# EAGLE design LSS (EAGLE 9.3.0)
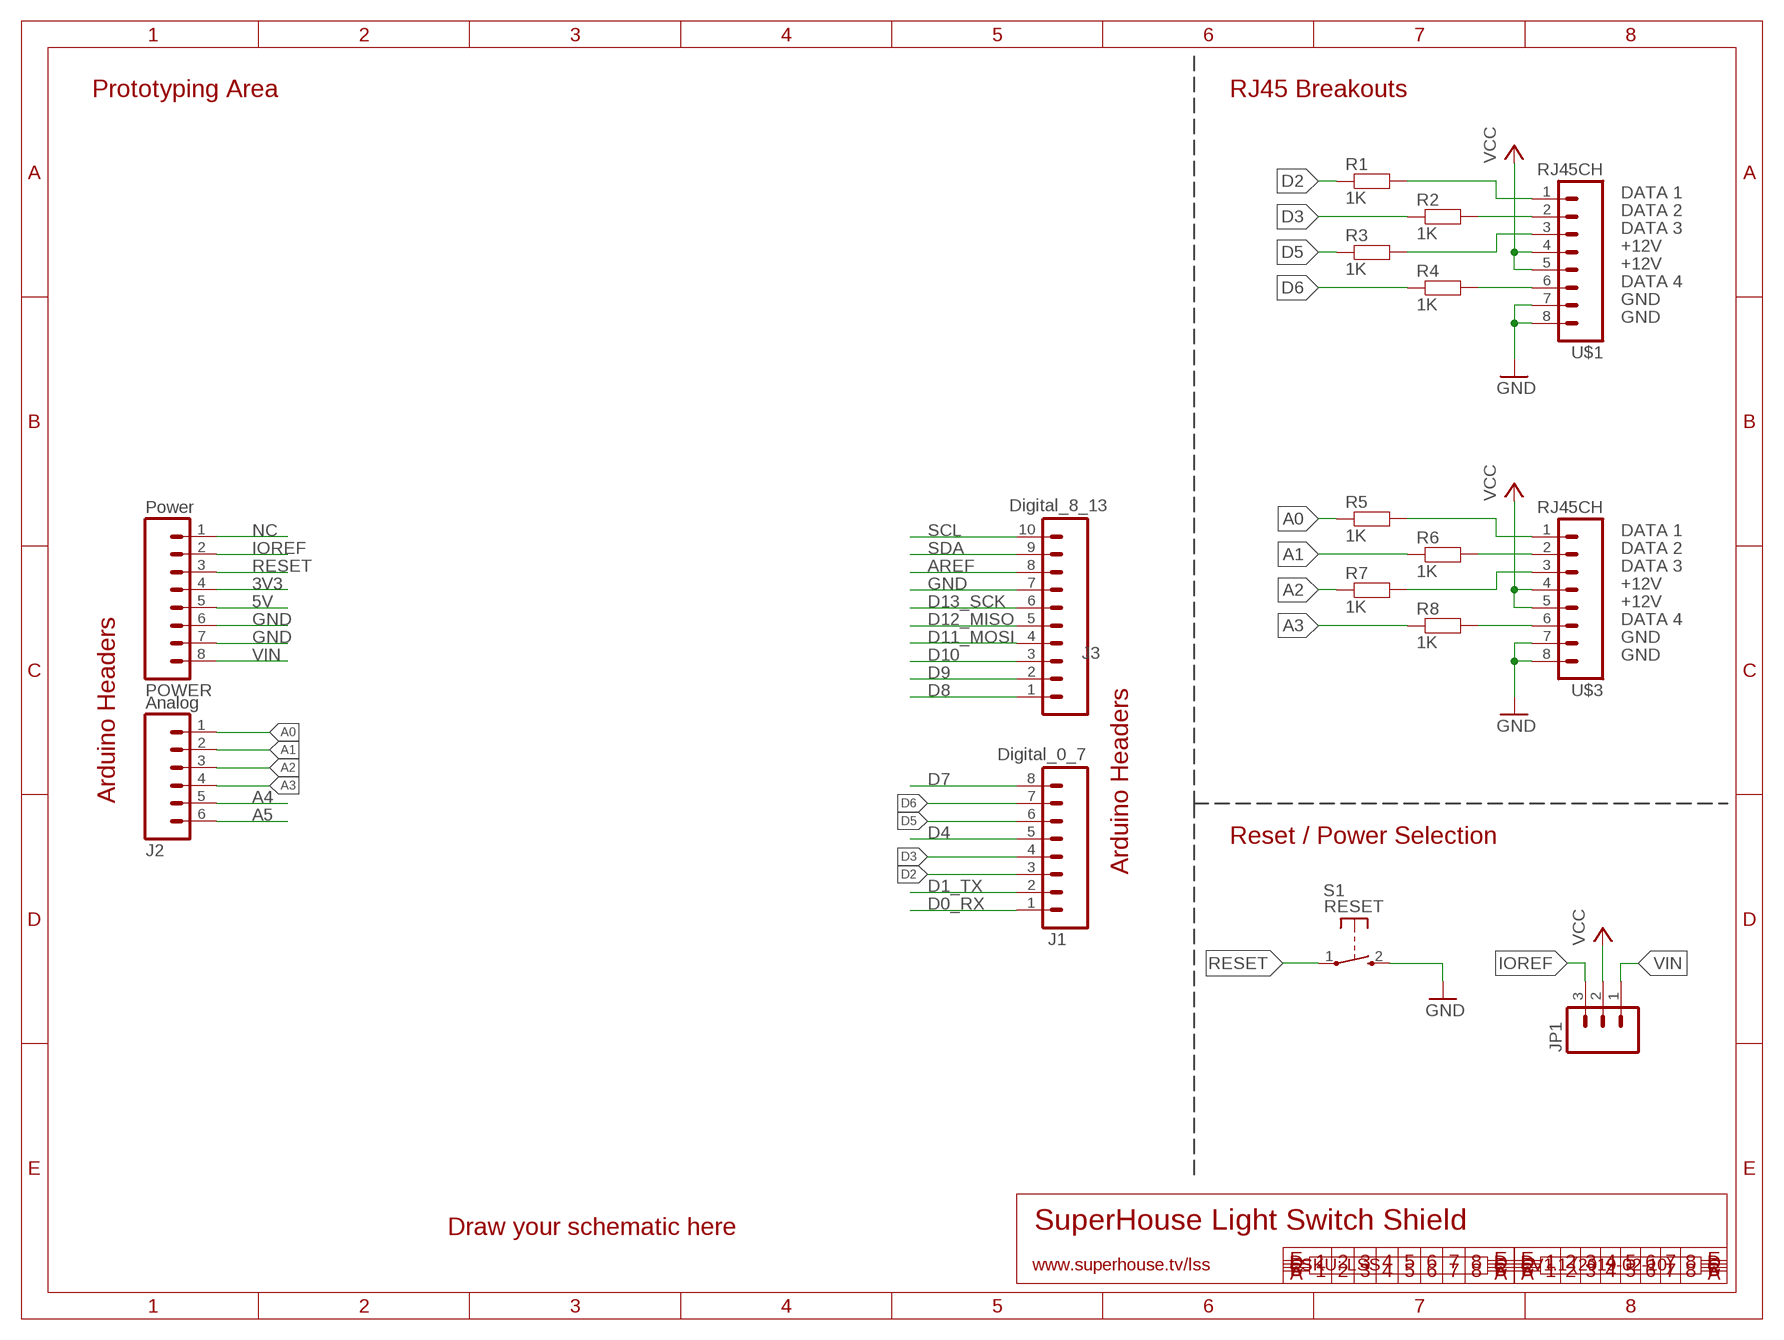
[diagram p0: schematic, sheet 1]

## Parts
J1  Digital_0_7  M08  [1X08]
J2  Analog  M06SIP  [1X06]
J3  Digital_8_13  M100.1  [1X10]
JP1  M03PTH  [1X03]
POWER  Power  M08  [1X08]
R1  1K  RESISTOR0603  [0603]
R2  1K  RESISTOR0603  [0603]
R3  1K  RESISTOR0603  [0603]
R4  1K  RESISTOR0603  [0603]
R5  1K  RESISTOR0603  [0603]
R6  1K  RESISTOR0603  [0603]
R7  1K  RESISTOR0603  [0603]
R8  1K  RESISTOR0603  [0603]
S1  RESET  TAC_SWITCH_2PINSMT  [TACTILE_SWITCH_SMD_2PIN_TINY]
U$1  RJ45CH  [RJ45CH]
U$3  RJ45CH  [RJ45CH]

## Nets
3V3: POWER.4
5V: POWER.5
A0: J2.1 R5.1
A1: J2.2 R6.1
A2: J2.3 R7.1
A3: J2.4 R8.1
A4: J2.5
A5: J2.6
AREF: J3.8
D0_RX: J1.1
D1_TX: J1.2
D2: J1.3 R1.1
D3: J1.4 R2.1
D4: J1.5
D5: J1.6 R3.1
D6: J1.7 R4.1
D7: J1.8
D8: J3.1
D9: J3.2
D10: J3.3
D11_MOSI: J3.4
D12_MISO: J3.5
D13_SCK: J3.6
GND: J3.7 POWER.6 POWER.7 S1.2(S) U$1.7 U$1.8 U$3.7 U$3.8
IOREF: JP1.3 POWER.2
N$1: R1.2 U$1.1
N$2: R2.2 U$1.2
N$3: R3.2 U$1.3
N$4: R4.2 U$1.6
N$5: R5.2 U$3.1
N$6: R6.2 U$3.2
N$7: R7.2 U$3.3
N$8: R8.2 U$3.6
NC: POWER.1
RESET: POWER.3 S1.1(P)
SCL: J3.10
SDA: J3.9
VCC: JP1.2 U$1.4 U$1.5 U$3.4 U$3.5
VIN: JP1.1 POWER.8

## Notes on the sheet
- Prototyping Area | RJ45 Breakouts
- DATA 1
- DATA 2
- DATA 3
- +12V
- +12V
- DATA 4
- GND
- GND
- DATA 1
- DATA 2
- DATA 3
- +12V
- +12V
- DATA 4
- GND
- GND
- Arduino Headers
- Reset / Power Selection
- Arduino Headers
- Draw your schematic here | SuperHouse Light Switch Shield
- www.superhouse.tv/lss | SKU: LSS | V1.1 (2019-02-10)

## Library data of the parts
J1 = freetronics:M08: Header 8 Standard 8-pin 0.1" header. Use with straight break away headers (SKU : PRT-00116), right angle break away headers (PRT-00553), swiss pins (PRT-00743), machine pins (PRT-00117), and female headers (PRT-00115).
J2 = freetronics:M06: Header 6 Standard 6-pin 0.1" header. Use with straight break away headers (SKU : PRT-00116), right angle break away headers (PRT-00553), swiss pins (PRT-00743), machine pins (PRT-00117), and female headers (PRT-00115). Molex polarized connector foot print use with SKU : PRT-08094 with associated crimp pins and housings. NOTES ON THE VARIANTS LOCK and LOCK_LONGPADS... This footprint was designed to help hold the alignment of a through-hole component (i.e. 6-pin header) while soldering it into place. You may notice that each hole has been shifted either up or down by 0.005 of an inch from it's more standard position (which is a perfectly straight line). This slight alteration caused the pins (the squares in the middle) to touch the edges of the holes. Because they are alternating, it causes a "brace" to hold the component in place. 0.005 has proven to be the perfect amount of "off-center" position when using our standard breakaway headers. Although looks a little odd when you look at the bare footprint, once you have a header in there, the alteration is very hard to notice. Also, if you push a header all the way into place, it is covered up entirely on the bottom side. This idea of altering the position of holes to aid alignment will be further integrated into the Sparkfun Library for other footprints. It can help hold any component with 3 or more connection pins.
J3 = freetronics-original:M10: Header 10 Standard 10-pin 0.1" header. Use with straight break away headers (SKU : PRT-00116), right angle break away headers (PRT-00553), swiss pins (PRT-00743), machine pins (PRT-00117), and female headers (PRT-00115).
JP1 = freetronics-jon:M03: Header 3 Standard 3-pin 0.1" header. Use with straight break away headers (SKU : PRT-00116), right angle break away headers (PRT-00553), swiss pins (PRT-00743), machine pins (PRT-00117), and female headers (PRT-00115). Molex polarized connector foot print use with SKU : PRT-08232 with associated crimp pins and housings.
POWER = freetronics-original:M08: Header 8 Standard 8-pin 0.1" header. Use with straight break away headers (SKU : PRT-00116), right angle break away headers (PRT-00553), swiss pins (PRT-00743), machine pins (PRT-00117), and female headers (PRT-00115).
R1-R8 = freetronics-jon:RESISTOR: Resistor Basic schematic elements and footprints for 0603, 1206, and PTH 1/10th watt (small) resistors.
S1 = freetronics-jon:TAC_SWITCH_2PIN: Momentary Tactile Switch - 2 pin
U$1 U$3 = freetronics-jon:RJ45

## Board
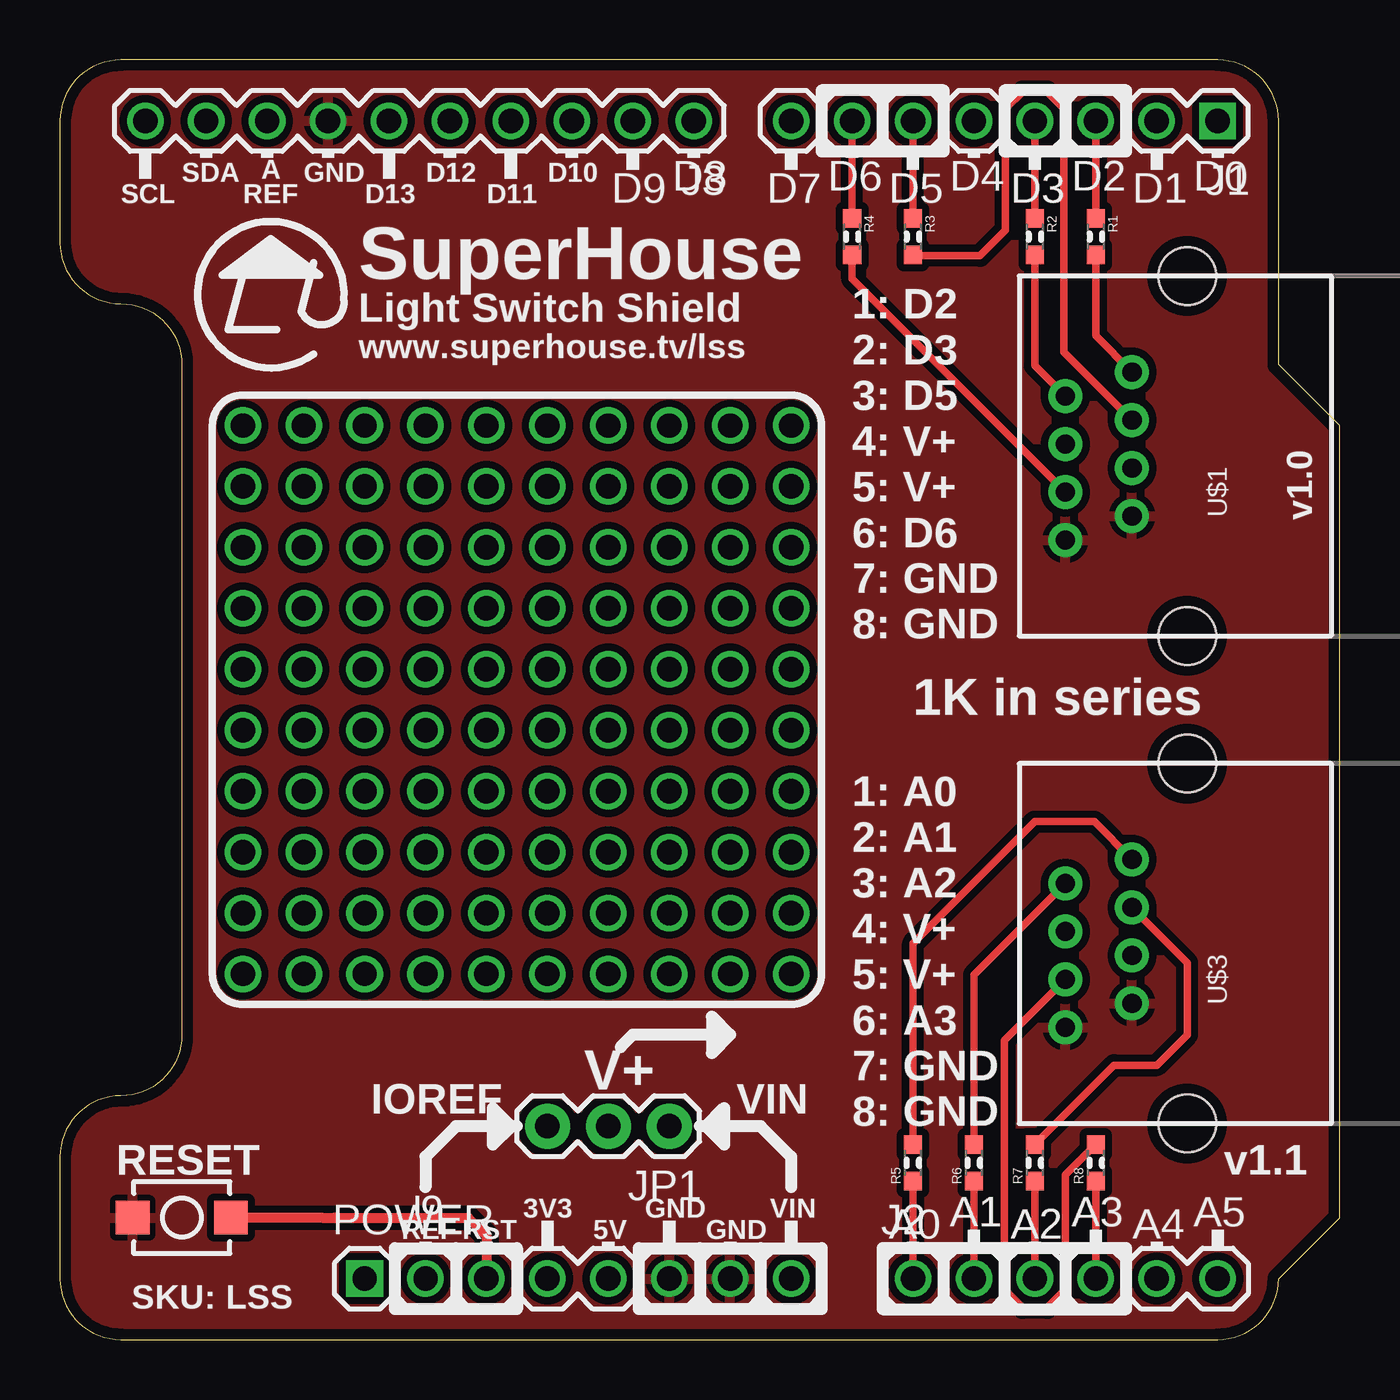
[diagram p1: board, top side]
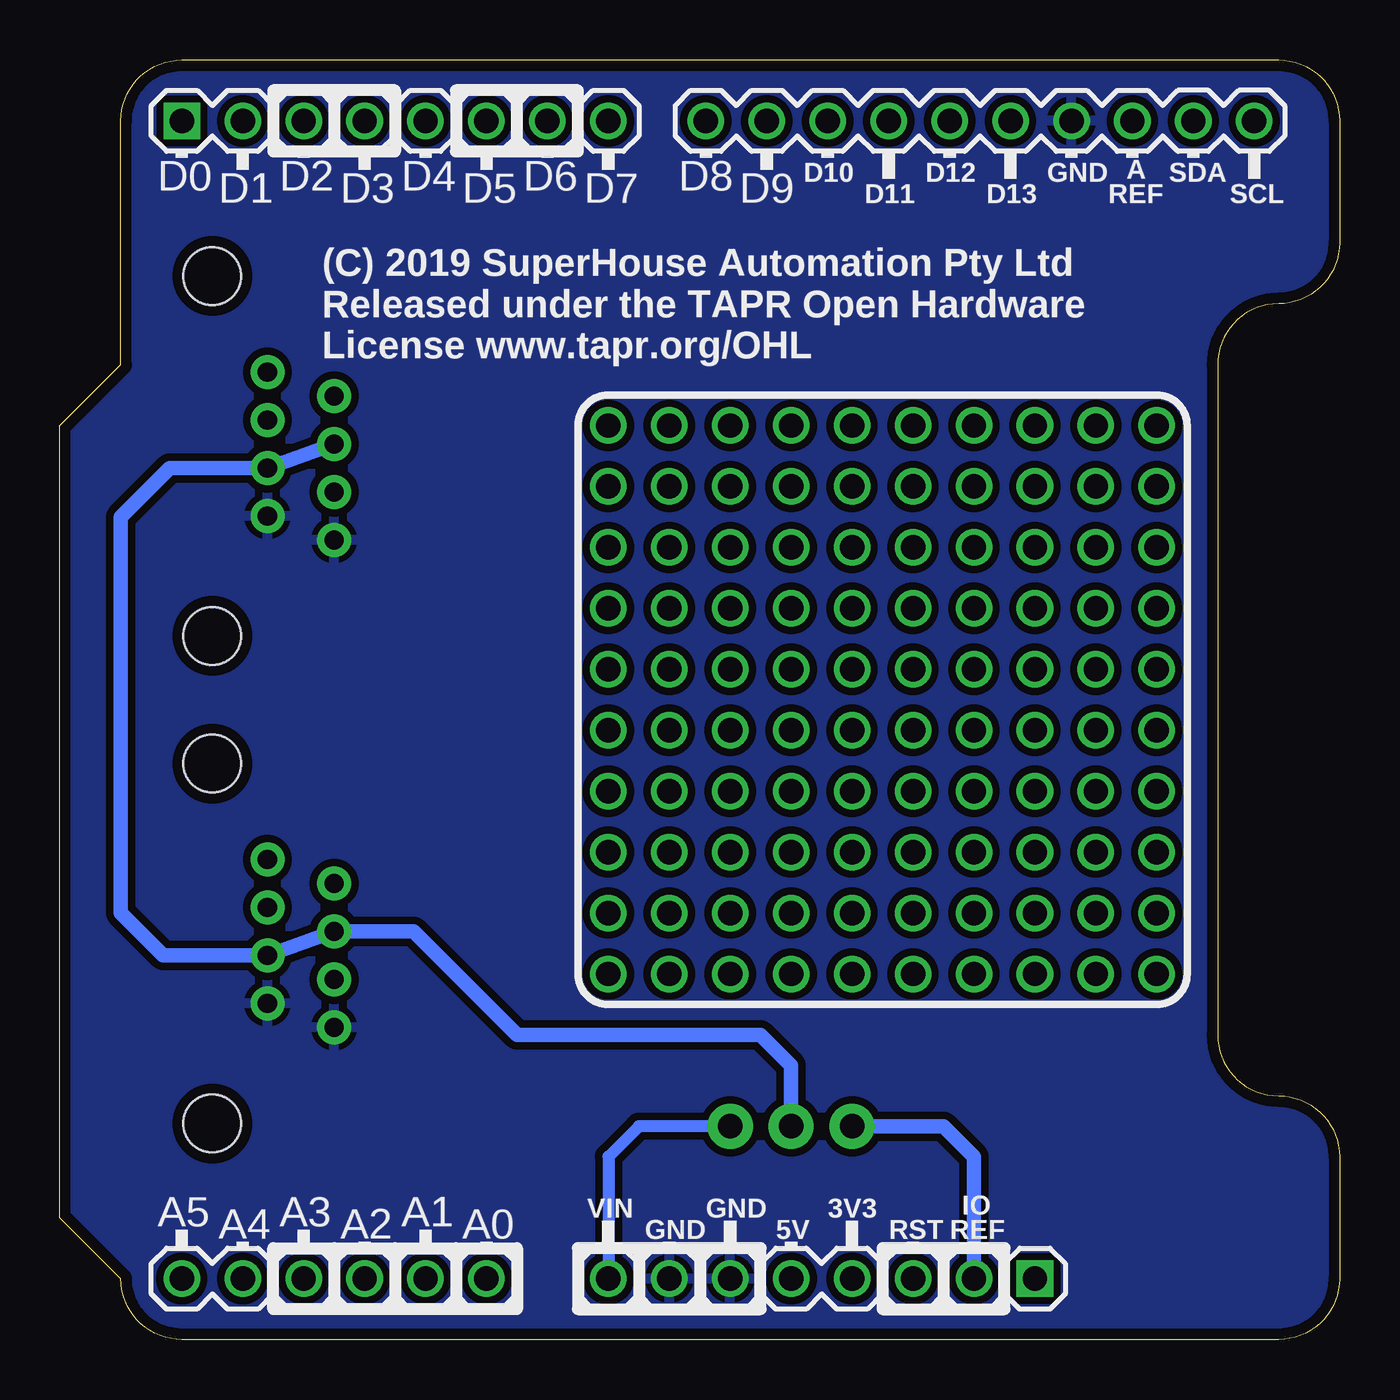
[diagram p2: board, bottom side, seen from below]

Size 53.34 x 53.34 mm. Coordinates in mm from the lower left corner, seen from the top.
Outline: 48.26,0 arc90 50.8,2.54 53.34,5.08 53.34,38.1 50.8,40.64 50.8,50.8 arc90 48.26,53.34 2.54,53.34 arc90 0,50.8 0,45.72 arc90 2.54,43.18 arc-90 5.08,40.64 5.08,12.7 arc-90 2.54,10.16 arc90 0,7.62 0,2.54 arc90 2.54,0 48.26,0
Copper layers (1*16): Top 0.035mm / dielectric 1.5mm / Bottom 0.035mm
Design rules "default *": minimum track width 10mil, minimum drill 24mil, track to track 12mil, track to pad 12mil, pad to pad 12mil, via to via 12mil, smd to smd 8mil, copper to edge 18mil, drill to drill 8mil, minimum pad ring 10mil, minimum via ring 8mil, stop-mask expansion 4mil, vias tented up to drill 0mil, thermal gap 10mil

### Footprints (pad centres in the part's own frame; a part is rotated, then mirrored left to right if it is on the bottom)
1X08 = drill 1.016 square: 1 0,0 | drill 1.016: 2 2.54,0; 3 5.08,0; 4 7.62,0; 5 10.16,0; 6 12.7,0; 7 15.24,0; 8 17.78,0
1X06 = drill 1.016: 1 0,0; 2 2.54,0; 3 5.08,0; 4 7.62,0; 5 10.16,0; 6 12.7,0
1X10 = drill 1.016: 1 0,0; 2 2.54,0; 3 5.08,0; 4 7.62,0; 5 10.16,0; 6 12.7,0; 7 15.24,0; 8 17.78,0; 9 20.32,0; 10 22.86,0
1X03 = drill 1.016 pad 1.88: 1 0,0; 2 2.54,0; 3 5.08,0
0603 = smd 0.762 x 0.762: 1 -0.762,0; 2 0.762,0
TACTILE_SWITCH_SMD_2PIN_TINY = smd 1.4 x 1.4: 1 -2.05,0; 2 2.05,0
RJ45CH = drill 0.8 pad 1.422: 1 3.5,2.3; 2 2.5,5.08; 3 1.5,2.3; 4 0.5,5.08; 5 -0.5,2.3; 6 -1.5,5.08; 7 -2.5,2.3; 8 -3.5,5.08 | hole 2.4: -7.5,0; 7.5,0

### Placement (x,y rotation side)
J1  48.26,50.8 180 top
J2  35.56,2.54 0 top
J3  26.42,50.8 180 top
JP1  25.4,8.89 180 top
POWER  12.7,2.54 0 top
R1  43.18,45.97 270 top
R2  40.64,45.97 270 top
R3  35.56,45.97 270 top
R4  33.02,45.97 270 top
R5  35.56,7.37 90 top
R6  38.1,7.37 90 top
R7  40.64,7.37 90 top
R8  43.18,7.37 90 top
S1  5.08,5.08 180 top
U$1  46.99,36.83 90 top
U$3  46.99,16.51 90 top

### Tracks (layer width: path | path; a pad name or v marks a point on that pad's centre or on a via)
A0
  Top 0.305: R5.1 J2.1
A1
  Top 0.305: R6.1 J2.2
A2
  Top 0.305: R7.1 J2.3
A3
  Top 0.305: R8.1 J2.4
D2
  Top 0.305: J1.3 R1.1
D3
  Top 0.305: R2.1 J1.4
D5
  Top 0.305: R3.1 J1.6
D6
  Top 0.305: R4.1 J1.7
GND
  pour Bottom: 0,50.8 arc-74 2.54,53.34 48.26,53.34 arc-74 50.8,50.8 50.8,40.64 53.34,38.1 53.34,5.08 50.8,2.54 arc-74 48.26,0 2.54,0 arc-74 0,2.54
  pour Top: 0,50.8 arc-74 2.54,53.34 48.26,53.34 arc-74 50.8,50.8 50.8,40.64 53.34,38.1 53.34,5.08 50.8,2.54 arc-74 48.26,0 2.54,0 arc-74 0,2.54
IOREF
  Bottom 0.61: POWER.2 15.24,7.62 16.51,8.89 JP1.3
N$1
  Top 0.305: R1.2 43.18,41.84 U$1.1
N$2
  Top 0.305: R2.2 40.64,40.6 U$1.2
N$3
  Top 0.305: R3.2 35.6,45.17 38.35,45.17 39.42,46.24 39.42,51.3 40.13,52.02 41.15,52.02 41.86,51.3 41.86,41.16 U$1.3
N$4
  Top 0.305: U$1.6 33.02,44.22 R4.2
N$5
  Top 0.305: R5.2 35.56,16.51 40.64,21.59 43.11,21.59 U$3.1
N$6
  Top 0.305: U$3.2 38.1,15.2 R6.2
N$7
  Top 0.305: R7.2 43.94,11.43 45.72,11.43 46.99,12.7 46.99,15.71 U$3.3
N$8
  Top 0.305: U$3.6 39.37,12.47 39.37,2.09 40.13,1.32 41.15,1.32 41.91,2.09 41.91,6.86 R8.2
N$9  (via drill 1.02)
  other vias: 27.94,15.24
N$10  (via drill 1.02)
  other vias: 25.4,15.24
N$11  (via drill 1.02)
  other vias: 27.94,17.78
N$12  (via drill 1.02)
  other vias: 25.4,17.78
N$13  (via drill 1.02)
  other vias: 27.94,20.32
N$14  (via drill 1.02)
  other vias: 25.4,20.32
N$15  (via drill 1.02)
  other vias: 27.94,22.86
N$16  (via drill 1.02)
  other vias: 25.4,22.86
N$17  (via drill 1.02)
  other vias: 27.94,25.4
N$18  (via drill 1.02)
  other vias: 22.86,15.24
N$19  (via drill 1.02)
  other vias: 20.32,15.24
N$20  (via drill 1.02)
  other vias: 17.78,15.24
N$21  (via drill 1.02)
  other vias: 15.24,15.24
N$22  (via drill 1.02)
  other vias: 25.4,25.4
N$23  (via drill 1.02)
  other vias: 27.94,27.94
N$24  (via drill 1.02)
  other vias: 25.4,27.94
N$25  (via drill 1.02)
  other vias: 27.94,30.48
N$26  (via drill 1.02)
  other vias: 25.4,30.48
N$27  (via drill 1.02)
  other vias: 27.94,33.02
N$28  (via drill 1.02)
  other vias: 25.4,33.02
N$29  (via drill 1.02)
  other vias: 27.94,35.56
N$30  (via drill 1.02)
  other vias: 25.4,35.56
N$31  (via drill 1.02)
  other vias: 27.94,38.1
N$32  (via drill 1.02)
  other vias: 25.4,38.1
N$33  (via drill 1.02)
  other vias: 30.48,15.24
N$34  (via drill 1.02)
  other vias: 22.86,17.78
N$35  (via drill 1.02)
  other vias: 20.32,17.78
N$36  (via drill 1.02)
  other vias: 17.78,17.78
N$37  (via drill 1.02)
  other vias: 15.24,17.78
N$38  (via drill 1.02)
  other vias: 30.48,17.78
N$39  (via drill 1.02)
  other vias: 30.48,20.32
N$40  (via drill 1.02)
  other vias: 30.48,22.86
N$41  (via drill 1.02)
  other vias: 30.48,25.4
N$42  (via drill 1.02)
  other vias: 30.48,27.94
N$43  (via drill 1.02)
  other vias: 30.48,30.48
N$44  (via drill 1.02)
  other vias: 30.48,33.02
N$45  (via drill 1.02)
  other vias: 30.48,35.56
N$46  (via drill 1.02)
  other vias: 30.48,38.1
N$50  (via drill 1.02)
  other vias: 22.86,20.32
N$51  (via drill 1.02)
  other vias: 20.32,20.32
N$52  (via drill 1.02)
  other vias: 17.78,20.32
N$53  (via drill 1.02)
  other vias: 15.24,20.32
N$66  (via drill 1.02)
  other vias: 22.86,22.86
N$67  (via drill 1.02)
  other vias: 20.32,22.86
N$68  (via drill 1.02)
  other vias: 17.78,22.86
N$69  (via drill 1.02)
  other vias: 15.24,22.86
N$82  (via drill 1.02)
  other vias: 22.86,25.4
N$83  (via drill 1.02)
  other vias: 20.32,25.4
N$84  (via drill 1.02)
  other vias: 17.78,25.4
N$85  (via drill 1.02)
  other vias: 15.24,25.4
N$98  (via drill 1.02)
  other vias: 22.86,27.94
N$99  (via drill 1.02)
  other vias: 20.32,27.94
N$100  (via drill 1.02)
  other vias: 17.78,27.94
N$101  (via drill 1.02)
  other vias: 15.24,27.94
N$114  (via drill 1.02)
  other vias: 22.86,30.48
N$115  (via drill 1.02)
  other vias: 20.32,30.48
N$116  (via drill 1.02)
  other vias: 17.78,30.48
N$117  (via drill 1.02)
  other vias: 15.24,30.48
N$130  (via drill 1.02)
  other vias: 22.86,33.02
N$131  (via drill 1.02)
  other vias: 20.32,33.02
N$132  (via drill 1.02)
  other vias: 17.78,33.02
N$133  (via drill 1.02)
  other vias: 15.24,33.02
N$146  (via drill 1.02)
  other vias: 22.86,35.56
N$147  (via drill 1.02)
  other vias: 20.32,35.56
N$148  (via drill 1.02)
  other vias: 17.78,35.56
N$149  (via drill 1.02)
  other vias: 15.24,35.56
N$162  (via drill 1.02)
  other vias: 22.86,38.1
N$163  (via drill 1.02)
  other vias: 20.32,38.1
N$164  (via drill 1.02)
  other vias: 17.78,38.1
N$165  (via drill 1.02)
  other vias: 15.24,38.1
N$204  (via drill 1.02)
  other vias: 12.7,15.24
N$205  (via drill 1.02)
  other vias: 12.7,17.78
N$206  (via drill 1.02)
  other vias: 12.7,20.32
N$207  (via drill 1.02)
  other vias: 12.7,22.86
N$208  (via drill 1.02)
  other vias: 12.7,25.4
N$209  (via drill 1.02)
  other vias: 12.7,27.94
N$210  (via drill 1.02)
  other vias: 12.7,30.48
N$211  (via drill 1.02)
  other vias: 12.7,33.02
N$212  (via drill 1.02)
  other vias: 12.7,35.56
N$213  (via drill 1.02)
  other vias: 12.7,38.1
N$215  (via drill 1.02)
  other vias: 10.16,15.24
N$216  (via drill 1.02)
  other vias: 10.16,17.78
N$217  (via drill 1.02)
  other vias: 10.16,20.32
N$218  (via drill 1.02)
  other vias: 10.16,22.86
N$219  (via drill 1.02)
  other vias: 10.16,25.4
N$220  (via drill 1.02)
  other vias: 10.16,27.94
N$221  (via drill 1.02)
  other vias: 10.16,30.48
N$222  (via drill 1.02)
  other vias: 10.16,33.02
N$223  (via drill 1.02)
  other vias: 10.16,35.56
N$224  (via drill 1.02)
  other vias: 10.16,38.1
N$226  (via drill 1.02)
  other vias: 7.62,15.24
N$227  (via drill 1.02)
  other vias: 7.62,17.78
N$228  (via drill 1.02)
  other vias: 7.62,20.32
N$229  (via drill 1.02)
  other vias: 7.62,22.86
N$230  (via drill 1.02)
  other vias: 7.62,25.4
N$231  (via drill 1.02)
  other vias: 7.62,27.94
N$232  (via drill 1.02)
  other vias: 7.62,30.48
N$233  (via drill 1.02)
  other vias: 7.62,33.02
N$234  (via drill 1.02)
  other vias: 7.62,35.56
N$235  (via drill 1.02)
  other vias: 7.62,38.1
RESET
  Top 0.406: POWER.3 17.78,4.32 17.02,5.08 11.43,5.08 10.92,5.08 S1.1
VCC
  Bottom 0.61: U$1.4 U$1.5 48.76,36.33 50.8,34.29 50.8,17.78 49.03,16.01 U$3.5 U$3.4 38.6,17.01 34.29,12.7 24.13,12.7 22.86,11.43 JP1.2
VIN
  Bottom 0.508: JP1.1 29.21,8.89 30.48,7.62 POWER.8

### Text on the board
tPlace: SDA | A | GND | D12 | D10 | D8 | D6 | D4 | D2 | D0 | SCL | REF | D13 | D11 | D9 | D7 | D5 | D3 | D1 | SuperHouse | Light Switch Shield | www.superhouse.tv/lss | v1.0 | 1: D2 / 2: D3 / 3: D5 / 4: V+ / 5: V+ / 6: D6 / 7: GND / 8: GND | 1K in series | V+ | IOREF | VIN | 1: A0 / 2: A1 / 3: A2 / 4: V+ / 5: V+ / 6: A3 / 7: GND / 8: GND | RESET | v1.1 | IO | 3V3 | GND | VIN | A1 | A3 | A5 | REF | RST | 5V | GND | A0 | A2 | A4 | SKU: LSS
bPlace: SDA | A | GND | D12 | D10 | D8 | D6 | D4 | D2 | D0 | SCL | REF | D13 | D11 | D9 | D7 | D5 | D3 | D1 | (C) 2019 SuperHouse Automation Pty Ltd / Released under the TAPR Open Hardware / License www.tapr.org/OHL | IO | 3V3 | GND | VIN | A1 | A3 | A5 | REF | RST | 5V | GND | A0 | A2 | A4